# Altium project PCB_Project.PrjPcb
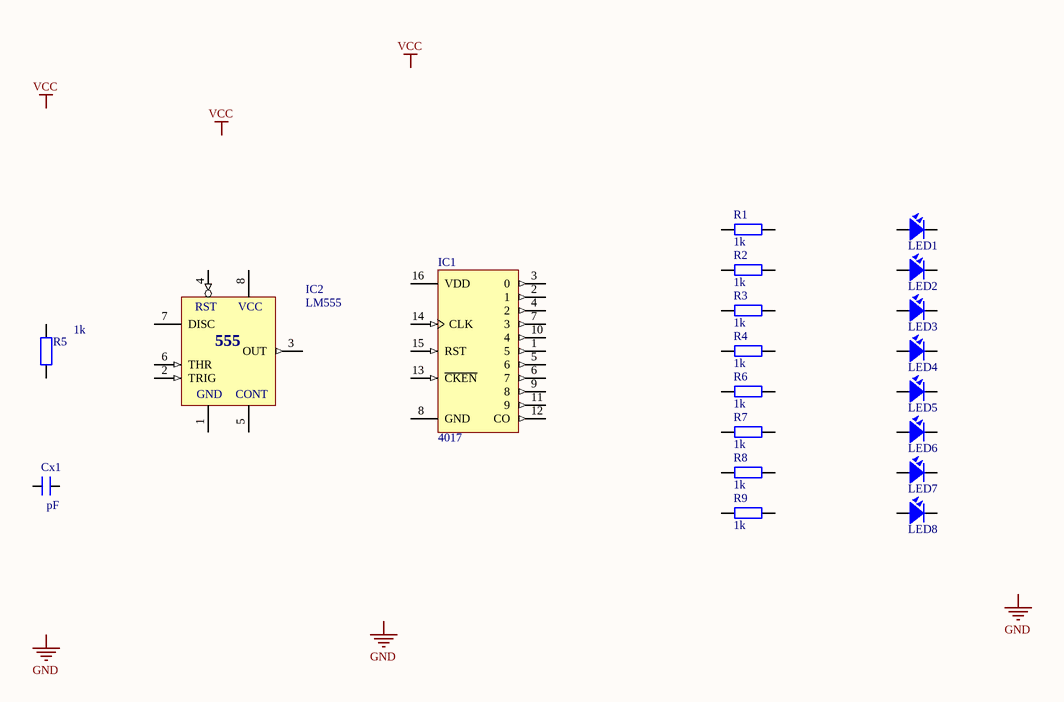
[diagram p0: Sheet1.SchDoc]
1 sheet, 20 parts. Net scope: global (net labels, ports and power ports of the same name join across sheets).
Board file: PCB2.PcbDoc

## Sheet Sheet1.SchDoc
size A

### Parts
Cx1  pF  [CN1]
IC1  4017  [DIP16/W0.3]
IC2  LM555  [DIP8/W0.3]
LED1  LED  [LED-3]  (value not drawn)
LED2  LED  [LED-3]  (value not drawn)
LED3  LED  [LED-3]  (value not drawn)
LED4  LED  [LED-3]  (value not drawn)
LED5  LED  [LED-3]  (value not drawn)
LED6  LED  [LED-3]  (value not drawn)
LED7  LED  [LED-3]  (value not drawn)
LED8  LED  [LED-3]  (value not drawn)
R1  1k  [R1/4W]
R2  1k  [R1/4W]
R3  1k  [R1/4W]
R4  1k  [R1/4W]
R5  1k  [R1/4W]
R6  1k  [R1/4W]
R7  1k  [R1/4W]
R8  1k  [R1/4W]
R9  1k  [R1/4W]

### Nets

Not connected (* = marked no-connect by the designer): Cx1 1 2; IC1 1(5) 2(1) 3(0) 4(2) 5(6) 6(7) 7(3) 8(GND) 9(8) 10(4) 11(9) 12(CO) 13(~{CKEN}) 14(CLK) 15(RST) 16(VDD); IC2 1(GND) 2(TRIG) 3(OUT) 4(RST) 5(CONT) 6(THR) 7(DISC) 8(VCC); LED1 1 2; LED2 1 2; LED3 1 2; LED4 1 2; LED5 1 2; LED6 1 2; LED7 1 2; LED8 1 2; R1 1 2; R2 1 2; R3 1 2; R4 1 2; R5 1 2; R6 1 2; R7 1 2; R8 1 2; R9 1 2

### Notes on the sheet
- Labels drawn without touching a wire or pin: GND, VCC
- (in symbol LM555) 555

### Library data of the parts
Cx1 = CN0: Cremic For Xtal 1pF => 100pF; Value: 33pF
IC1 = 4017: Decade Counter/Divider with 10 Decoded Outputs; Designed by: VanDungEvn; Value: CD4017
IC2 = LM555: Timer; Value: LM555
LED1-LED8 = LED: LED Single colour Green and Red; Value: LED 3 ly Single Colour
R1-R9 = R1/4W: Resistor 1/4W; Value: R1/4W - 1K